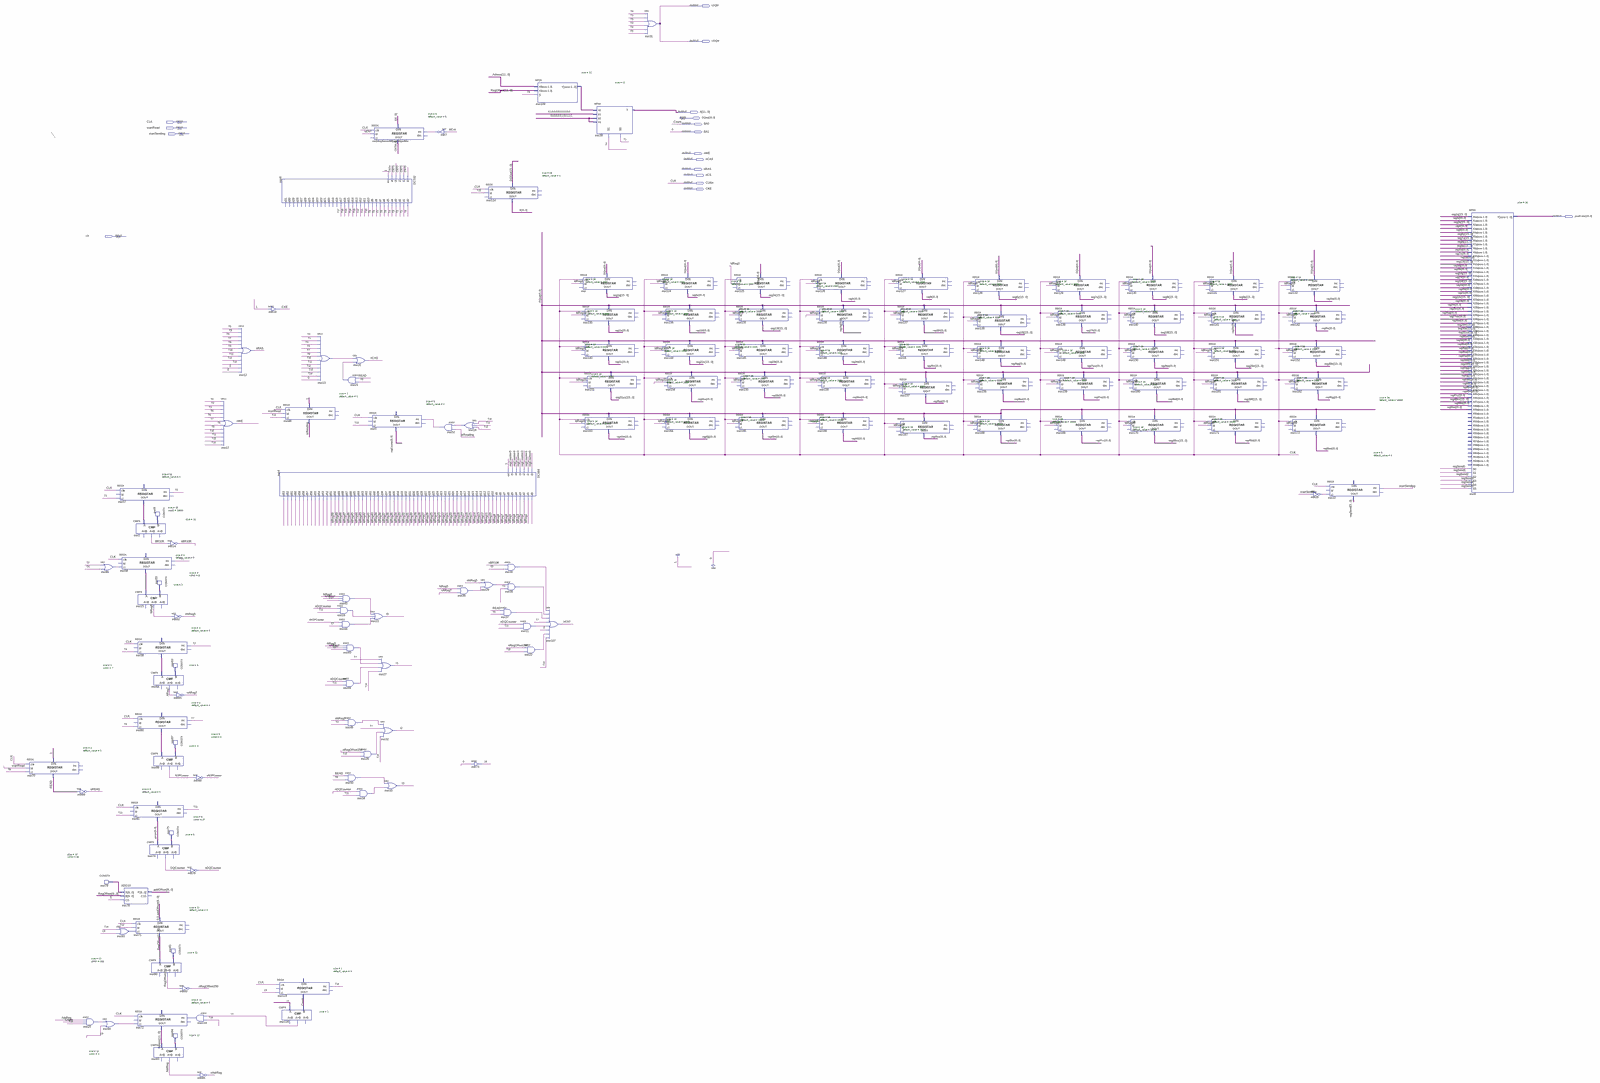
[diagram p0: schematic sheet, whole]
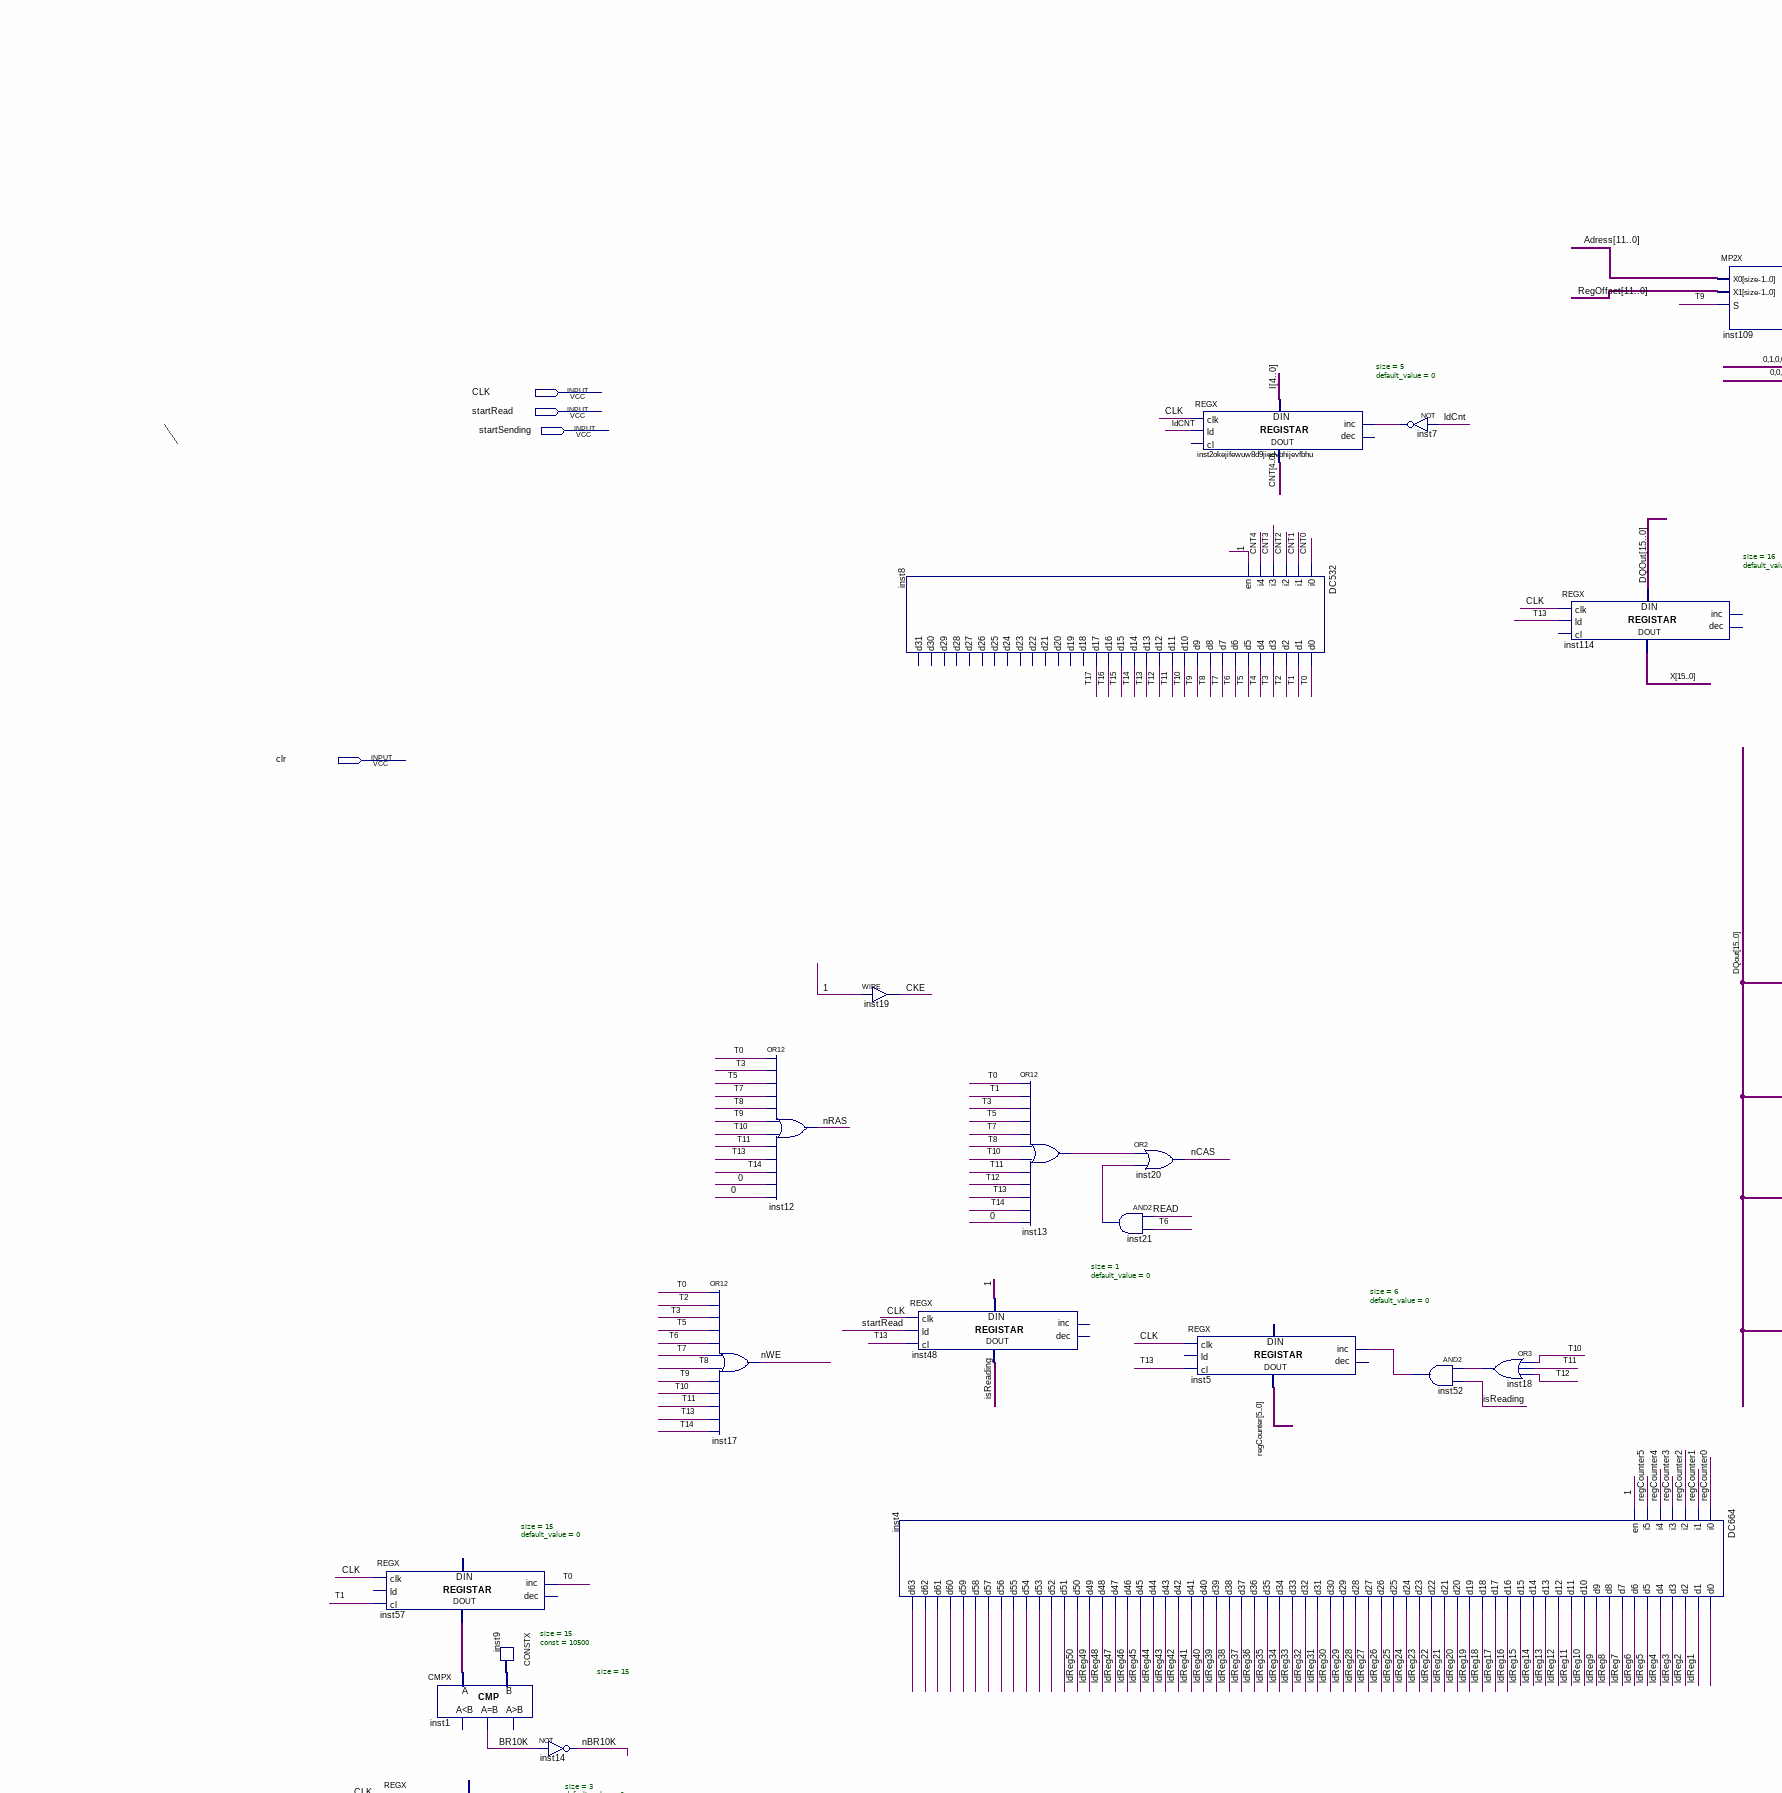
[diagram p1: schematic sheet, upper left part]
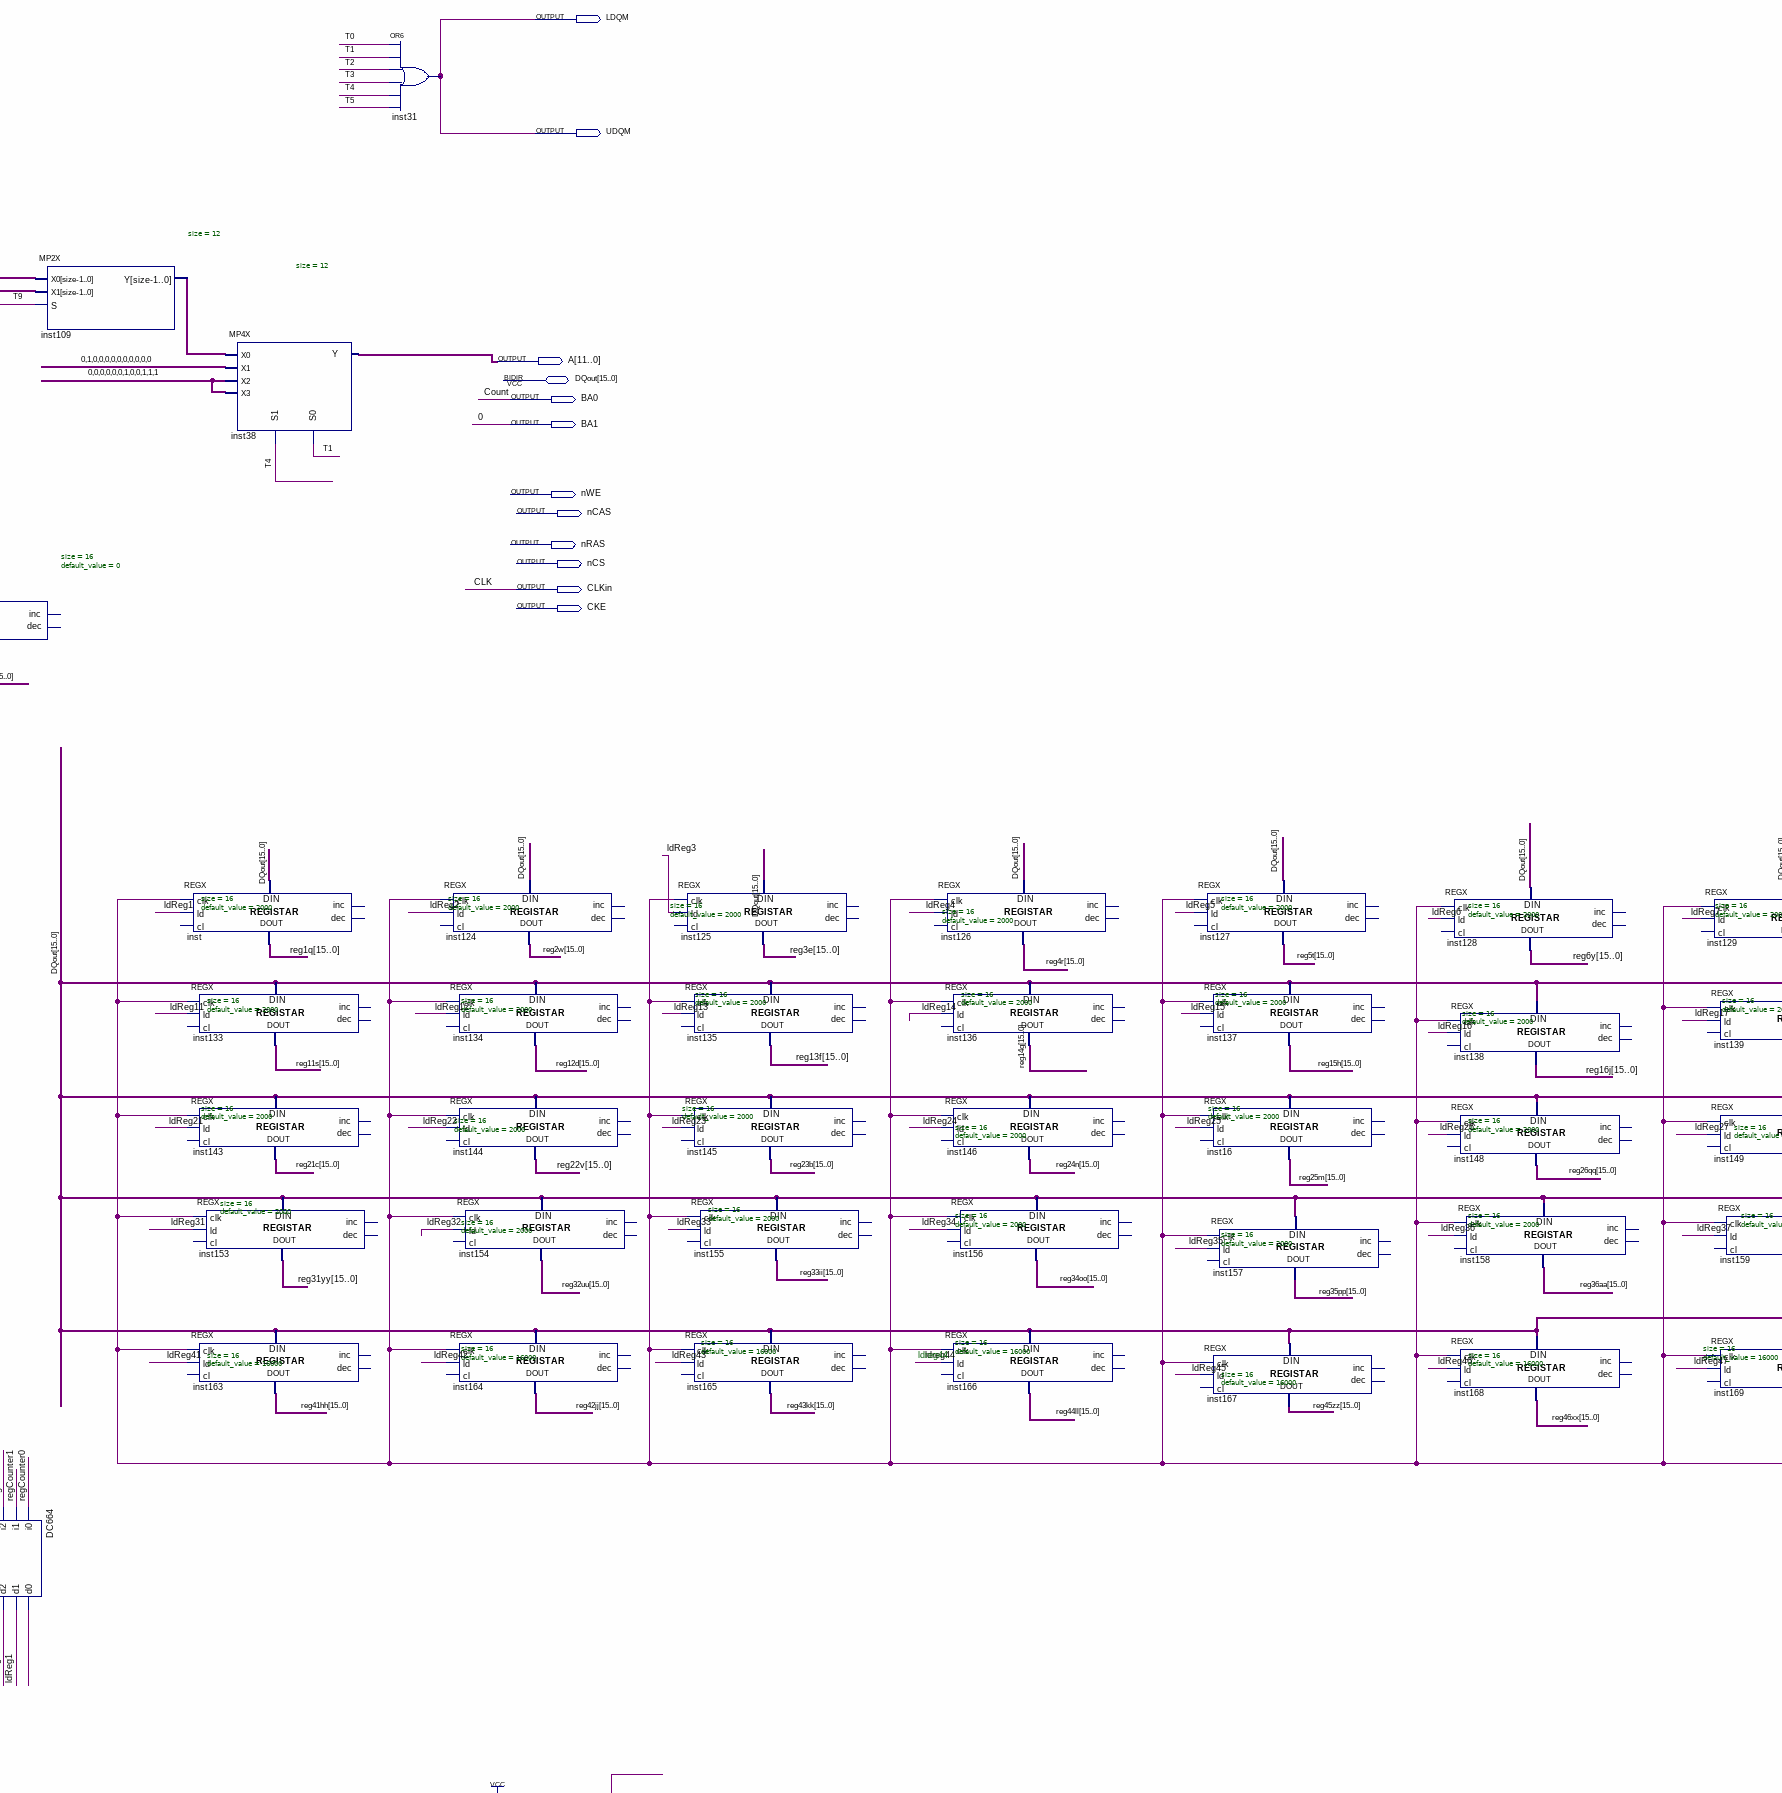
[diagram p2: schematic sheet, upper centre part]
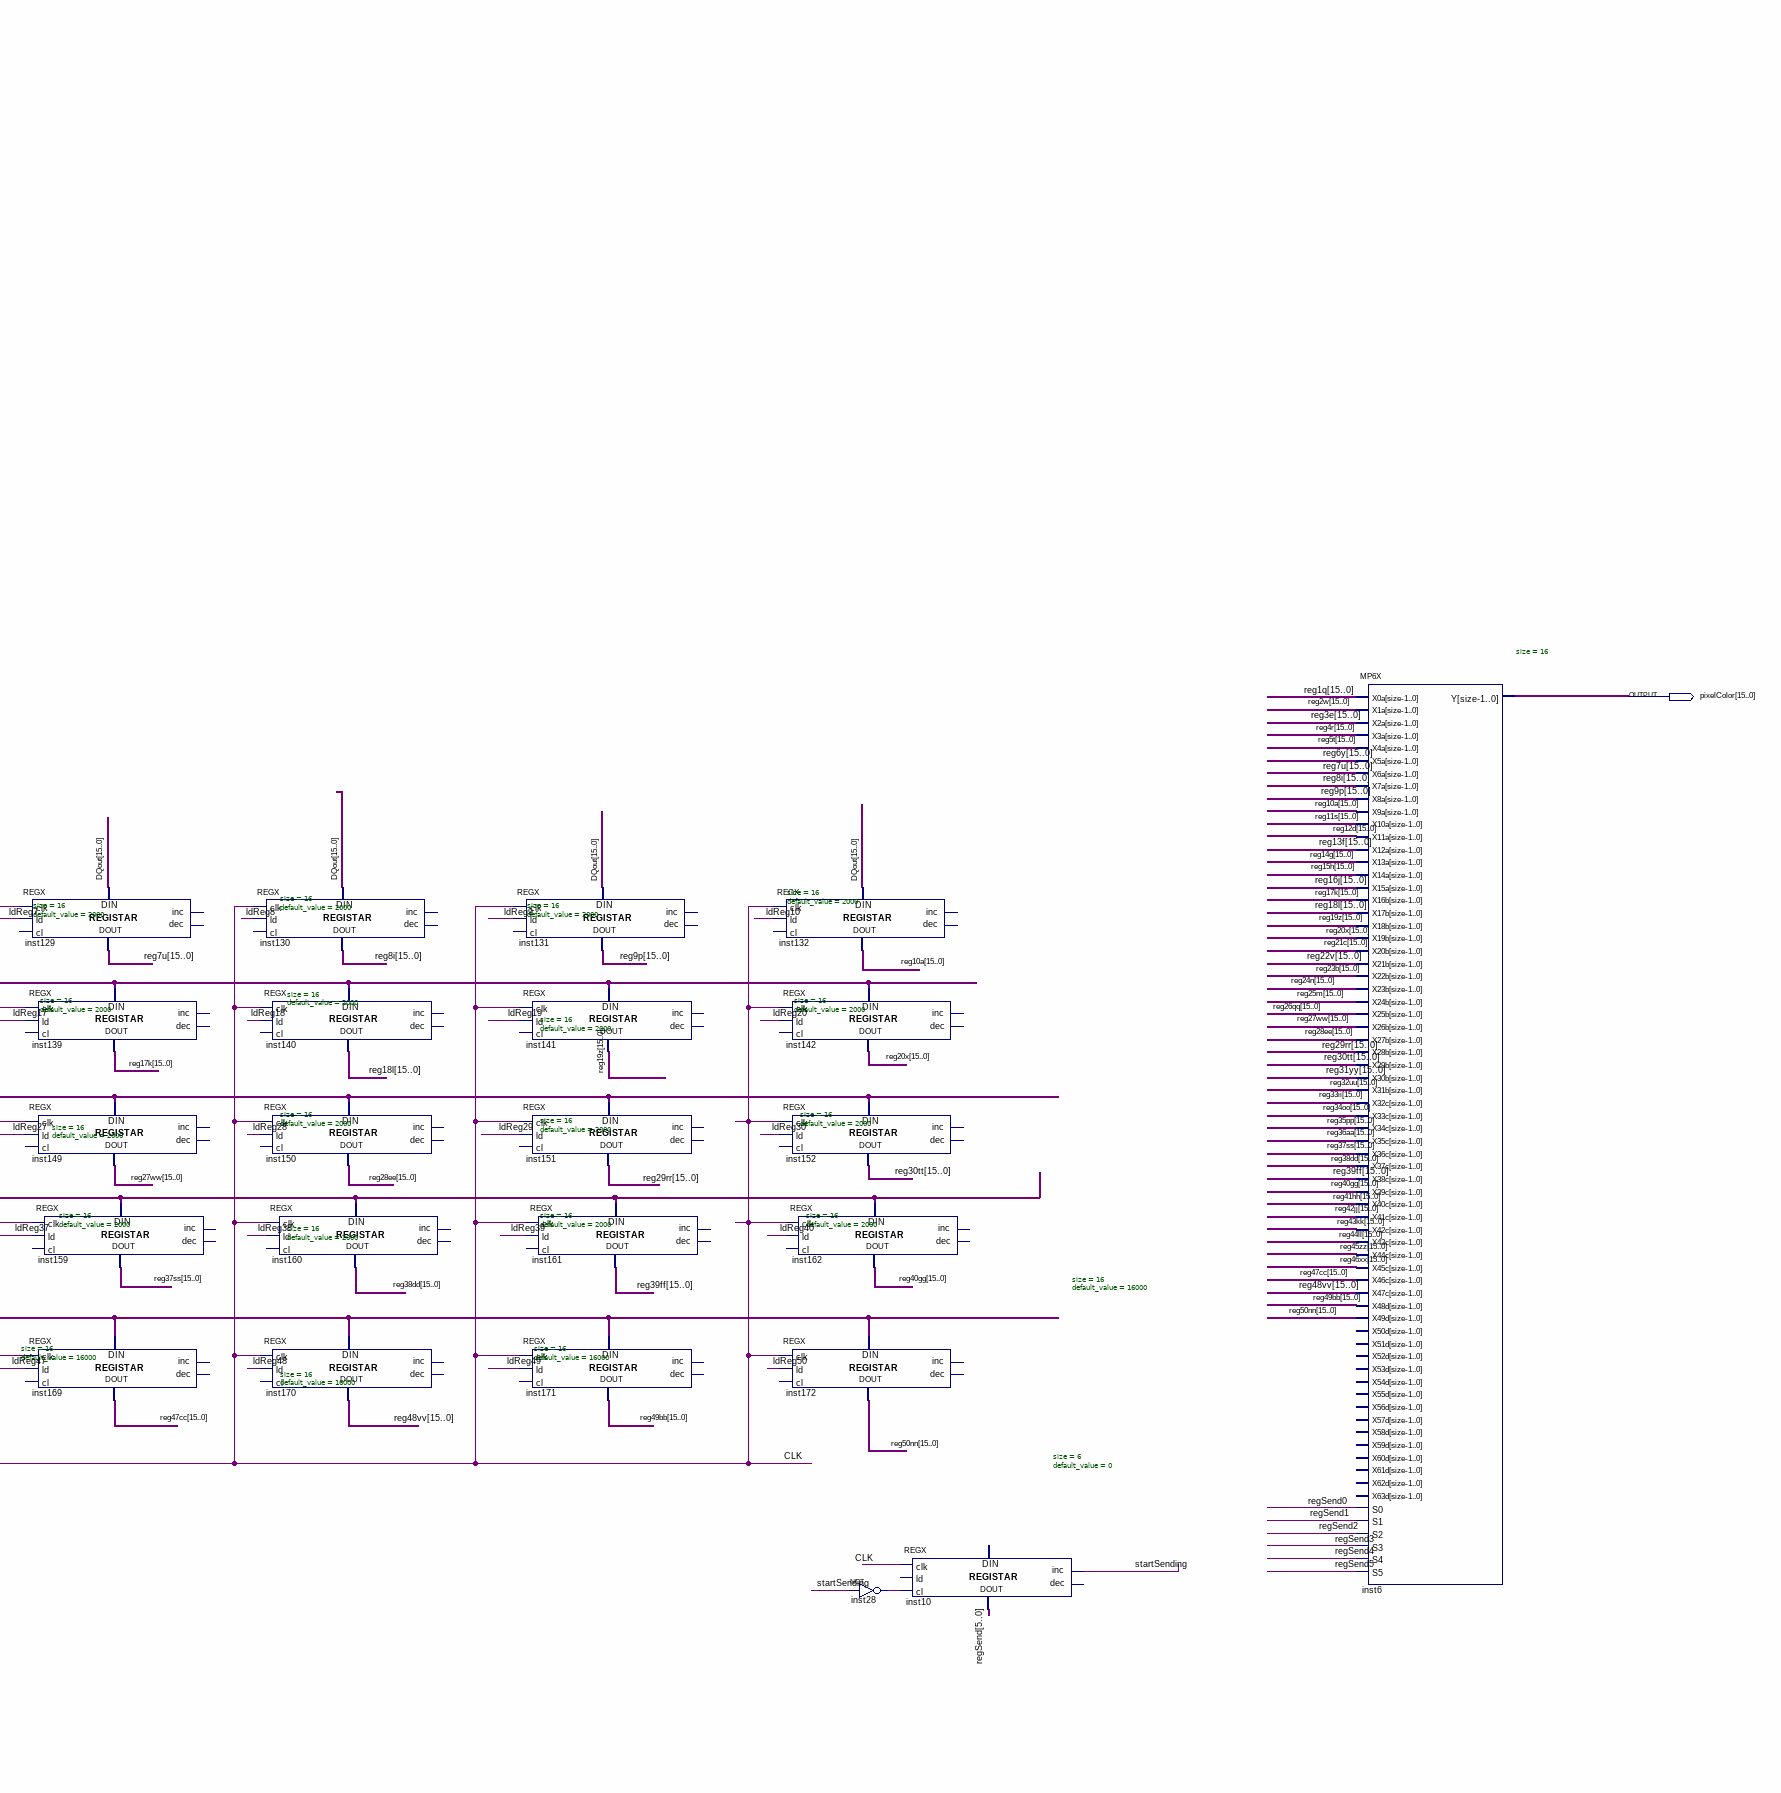
[diagram p3: schematic sheet, upper right part]
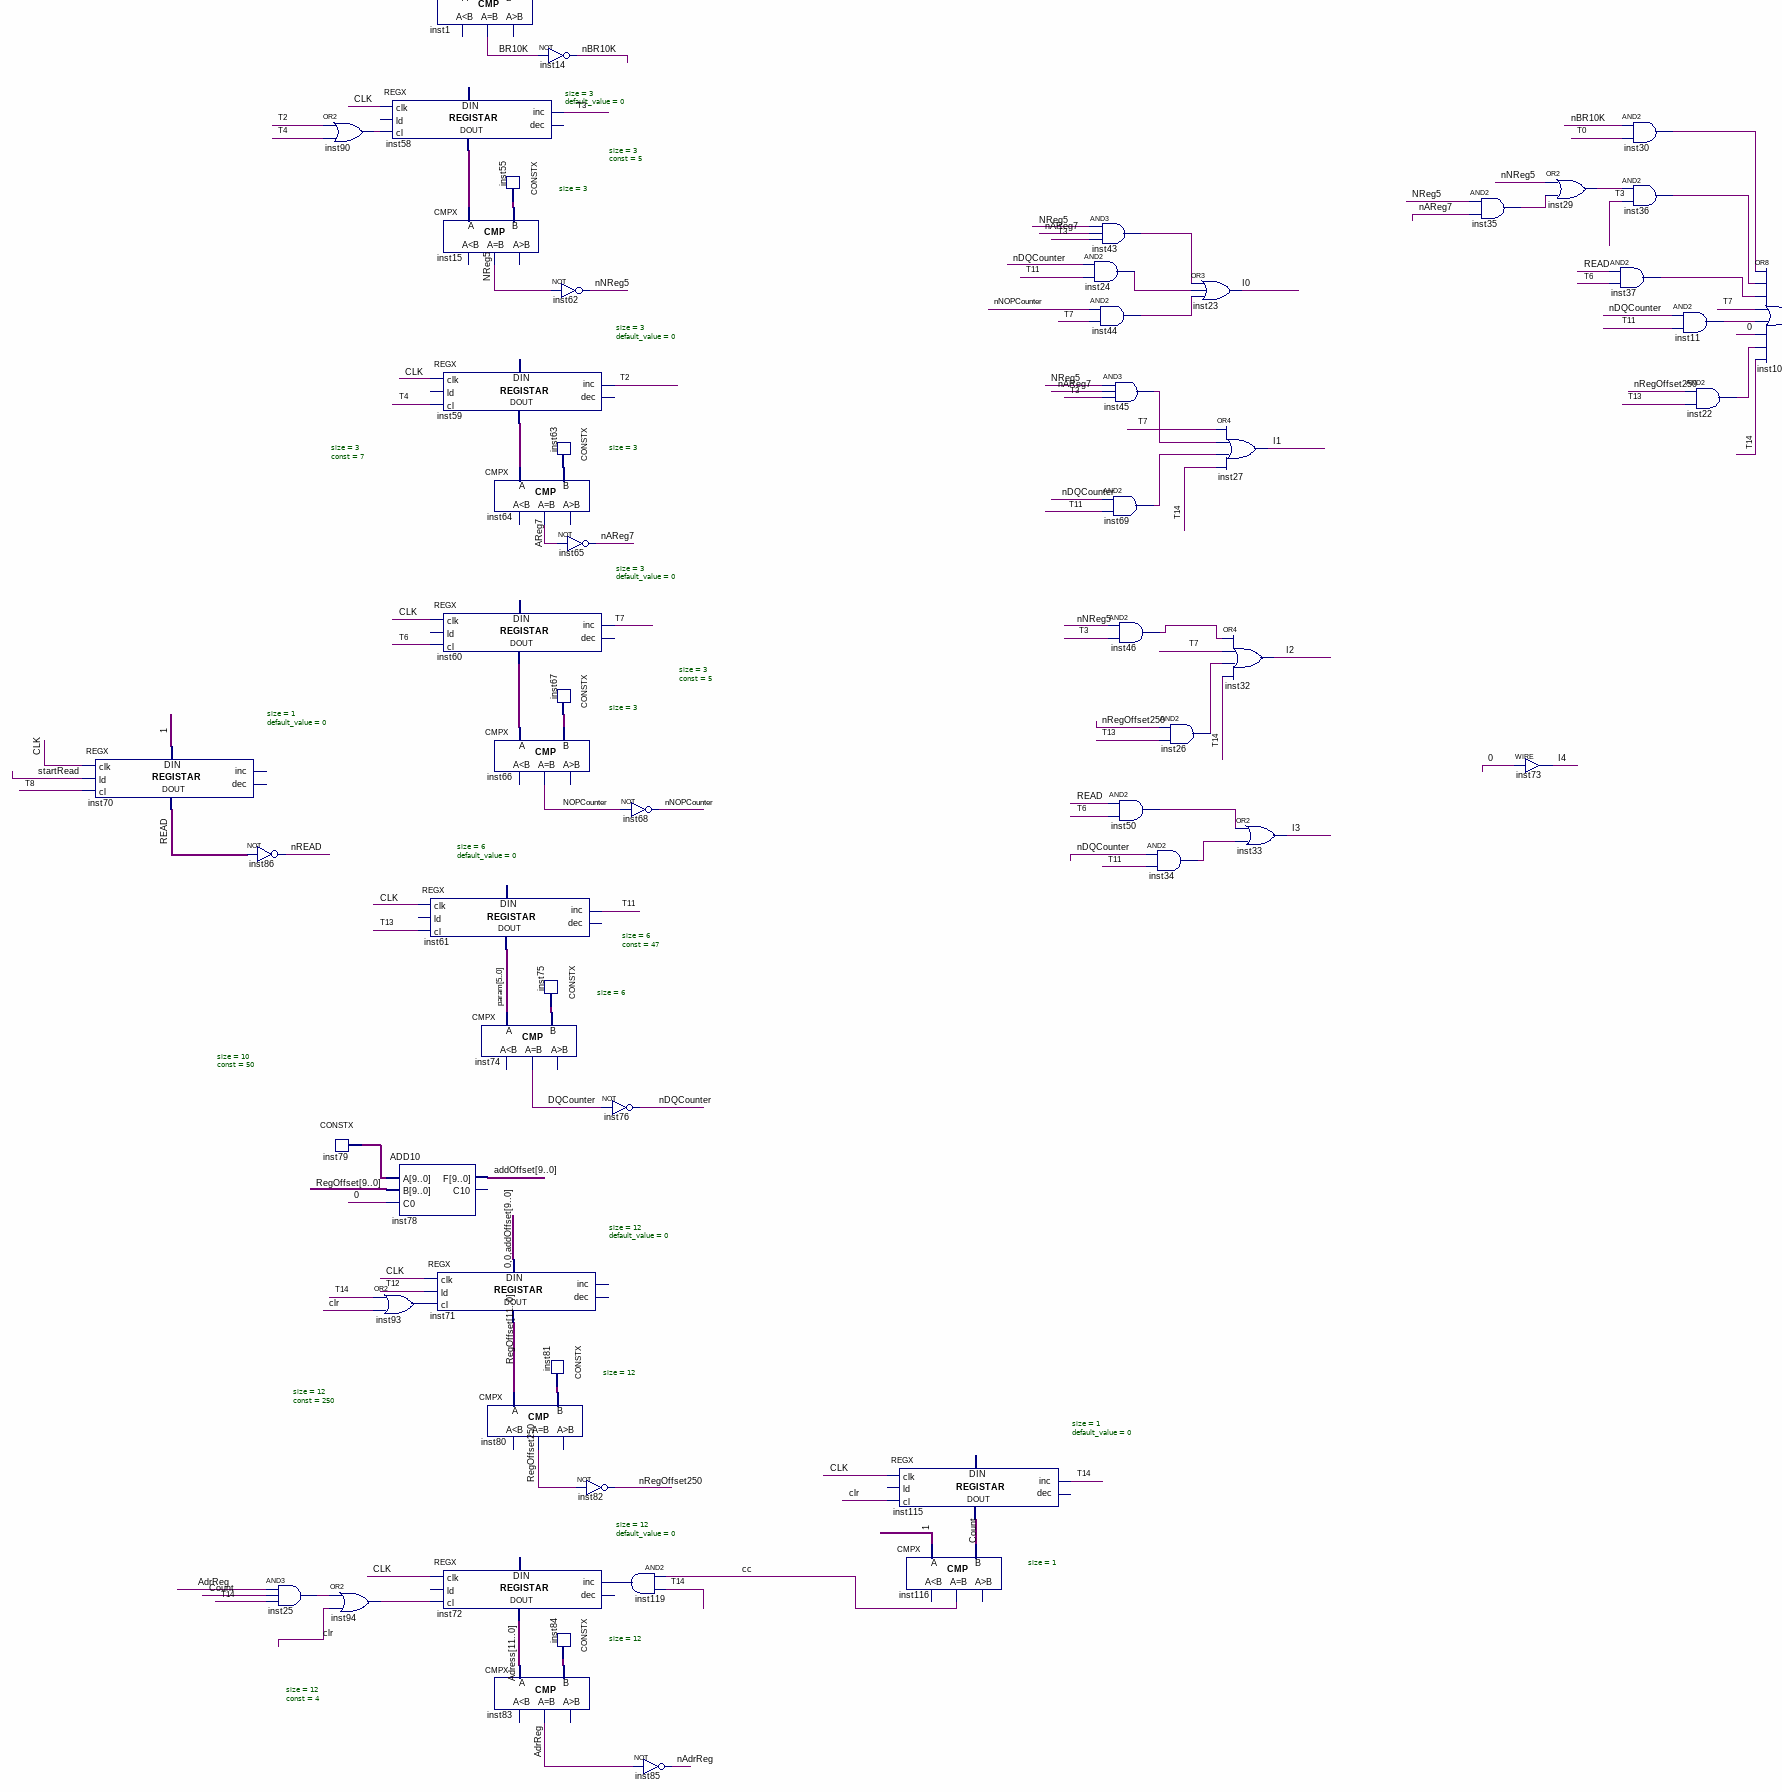
[diagram p4: schematic sheet, lower left part]
// Quartus schematic MemoryController.bdf as structural Verilog: 132 symbols, 17 pins
module MemoryController (
  input  CLK,
  input  startRead,
  input  startSending,
  input  clr,
  inout  [15:0] DQout,
  output LDQM,
  output UDQM,
  output [11:0] A,
  output BA0,
  output BA1,
  output nWE,
  output nCAS,
  output nRAS,
  output nCS,
  output CLKin,
  output CKE,
  output [15:0] pixelColor
);

  wire AdrReg, AReg7, BR10K, cc, DQCounter, inst4_d0, inst4_d51, inst4_d52, inst4_d53, inst4_d54, inst4_d55,
       inst4_d56, inst4_d57, inst4_d58, inst4_d59, inst4_d60, inst4_d61, inst4_d62, inst4_d63, inst7_out,
       inst11_out, inst13_out, inst18_out, inst21_out, inst22_out, inst24_out, inst25_out, inst26_out,
       inst28_out, inst29_out, inst30_out, inst34_out, inst35_out, inst36_out, inst37_out, inst43_out,
       inst44_out, inst45_out, inst46_out, inst50_out, inst52_out, inst69_out, inst90_out, inst93_out,
       inst94_out, inst119_out, isReading, ldCnt, ldReg1, ldReg2, ldReg3, ldReg4, ldReg5, ldReg6, ldReg7,
       ldReg8, ldReg9, ldReg10, ldReg11, ldReg12, ldReg13, ldReg14, ldReg15, ldReg16, ldReg17, ldReg18,
       ldReg19, ldReg20, ldReg21, ldReg22, ldReg23, ldReg24, ldReg25, ldReg26, ldReg27, ldReg28, ldReg29,
       ldReg30, ldReg31, ldReg32, ldReg33, ldReg34, ldReg35, ldReg36, ldReg37, ldReg38, ldReg39, ldReg40,
       ldReg41, ldReg42, ldReg43, ldreg44, ldReg45, ldReg46, ldReg47, ldReg48, ldReg49, ldReg50, nAdrReg,
       nAReg7, nBR10K, nDQCounter, nNOPCounter, nNReg5, NOPCounter, nREAD, NReg5, nRegOffset250, READ,
       RegOffset250, T0, T1, T2, T3, T4, T5, T6, T7, T8, T9, T10, T11, T12, T13, T14, T15, T16, T17;
  wire [2:0] inst55_data, inst58_data_out, inst59_data_out, inst60_data_out, inst63_data, inst67_data;
  wire [4:0] CNT, I;
  wire [5:0] inst75_data, param, regCounter, regSend;
  wire [9:0] addOffset, inst79_data;
  wire [11:0] Adress, inst81_data, inst84_data, inst109_y, RegOffset;
  wire [14:0] inst9_data, inst57_data_out;
  wire [15:0] reg1q, reg2w, reg3e, reg4r, reg5t, reg6y, reg7u, reg8i, reg9p, reg10a, reg11s, reg12d, reg13f,
       reg14g, reg15h, reg16j, reg17k, reg18l, reg19z, reg20x, reg21c, reg22v, reg23b, reg24n, reg25m,
       reg26qq, reg27ww, reg28ee, reg29rr, reg30tt, reg31yy, reg32uu, reg33ii, reg34oo, reg35pp, reg36aa,
       reg37ss, reg38dd, reg39ff, reg40gg, reg41hh, reg42jj, reg43kk, reg44ll, reg45zz, reg46xx, reg47cc,
       reg48vv, reg49bb, reg50nn, X;

  REGX #(.size(1), .default_value(0)) inst70 (
    .clk(CLK), .ld(startRead), .cl(T8), .data_in(1'b1), .data_out(READ));  // open: inc, dec
  not inst86 (nREAD, READ);
  and inst25 (inst25_out, AdrReg, BA0, T14);
  CONSTX #(.size(10), .\const (50)) inst79 (.data(inst79_data));
  or inst90 (inst90_out, T2, T4);
  or inst94 (inst94_out, inst25_out, clr);
  REGX #(.size(15), .default_value(0)) inst57 (
    .clk(CLK), .cl(T1), .inc(T0), .data_out(inst57_data_out));  // open: ld, dec, data_in
  REGX #(.size(3), .default_value(0)) inst58 (
    .clk(CLK), .cl(inst90_out), .inc(T3), .data_out(inst58_data_out));  // open: ld, dec, data_in
  REGX #(.size(6), .default_value(0)) inst61 (
    .clk(CLK), .cl(T13), .inc(T11), .data_out(param));  // open: ld, dec, data_in
  ADD10 inst78 (.A(inst79_data), .B(RegOffset[9:0]), .C0(1'b0), .F(addOffset));  // open: C10
  or inst93 (inst93_out, T14, clr);
  CMPX #(.size(15)) inst1 (.A(inst57_data_out), .B(inst9_data), .eq(BR10K));  // open: ls, gr
  CMPX #(.size(3)) inst15 (.A(inst58_data_out), .B(inst55_data), .eq(NReg5));  // open: ls, gr
  REGX #(.size(3), .default_value(0)) inst59 (
    .clk(CLK), .cl(T4), .inc(T2), .data_out(inst59_data_out));  // open: ld, dec, data_in
  REGX #(.size(3), .default_value(0)) inst60 (
    .clk(CLK), .cl(T6), .inc(T7), .data_out(inst60_data_out));  // open: ld, dec, data_in
  CMPX #(.size(6)) inst74 (.A(param), .B(inst75_data), .eq(DQCounter));  // open: ls, gr
  REGX #(.size(12), .default_value(0)) inst71 (
    .clk(CLK), .ld(T12), .cl(inst93_out), .data_in({2'b00, addOffset}), .data_out(RegOffset));  // open: inc, dec
  REGX #(.size(12), .default_value(0)) inst72 (
    .clk(CLK), .cl(inst94_out), .inc(inst119_out), .data_out(Adress));  // open: ld, dec, data_in
  CONSTX #(.size(15), .\const (10500)) inst9 (.data(inst9_data));
  CONSTX #(.size(3), .\const (5)) inst55 (.data(inst55_data));
  CMPX #(.size(3)) inst64 (.A(inst59_data_out), .B(inst63_data), .eq(AReg7));  // open: ls, gr
  CMPX #(.size(3)) inst66 (.A(inst60_data_out), .B(inst67_data), .eq(NOPCounter));  // open: ls, gr
  CMPX #(.size(12)) inst80 (.A(RegOffset), .B(inst81_data), .eq(RegOffset250));  // open: ls, gr
  CMPX #(.size(12)) inst83 (.A(Adress), .B(inst84_data), .eq(AdrReg));  // open: ls, gr
  not inst14 (nBR10K, BR10K);
  not inst62 (nNReg5, NReg5);
  CONSTX #(.size(3), .\const (7)) inst63 (.data(inst63_data));
  not inst65 (nAReg7, AReg7);
  CONSTX #(.size(3), .\const (5)) inst67 (.data(inst67_data));
  CONSTX #(.size(6), .\const (47)) inst75 (.data(inst75_data));
  CONSTX #(.size(12), .\const (250)) inst81 (.data(inst81_data));
  CONSTX #(.size(12), .\const (4)) inst84 (.data(inst84_data));
  not inst68 (nNOPCounter, NOPCounter);
  not inst76 (nDQCounter, DQCounter);
  not inst82 (nRegOffset250, RegOffset250);
  and inst119 (inst119_out, cc, T14);
  not inst85 (nAdrReg, AdrReg);
  or inst17 (nWE, T0, T2, T3, T5, T6, T7, T8, T9, T10, T11, T13, T14);
  or inst12 (nRAS, T0, T3, T5, T7, T8, T9, T10, T11, T13, T14, 1'b0, 1'b0);
  assign CKE = 1'b1;  // WIRE inst19
  DC532 inst8 (
    .i0(CNT[0]), .i1(CNT[1]), .i2(CNT[2]), .i3(CNT[3]), .i4(CNT[4]), .en(1'b1), .d0(T0), .d1(T1), .d2(T2),
    .d3(T3), .d4(T4), .d5(T5), .d6(T6), .d7(T7), .d8(T8), .d9(T9), .d10(T10), .d11(T11), .d12(T12),
    .d13(T13), .d14(T14), .d15(T15), .d16(T16), .d17(T17));  // open: d18, d19, d20, d21, d22, d23, d24, d25, d26, d27, d28, d29, d30, d31
  REGX #(.size(1), .default_value(0)) inst48 (
    .clk(CLK), .ld(startRead), .cl(T13), .data_in(1'b1), .data_out(isReading));  // open: inc, dec
  DC664 inst4 (
    .i0(regCounter[0]), .i1(regCounter[1]), .i2(regCounter[2]), .i3(regCounter[3]), .i4(regCounter[4]),
    .i5(regCounter[5]), .en(1'b1), .d0(inst4_d0), .d1(ldReg1), .d2(ldReg2), .d3(ldReg3), .d4(ldReg4),
    .d5(ldReg5), .d6(ldReg6), .d7(ldReg7), .d8(ldReg8), .d9(ldReg9), .d10(ldReg10), .d11(ldReg11),
    .d12(ldReg12), .d13(ldReg13), .d14(ldReg14), .d15(ldReg15), .d16(ldReg16), .d17(ldReg17), .d18(ldReg18),
    .d19(ldReg19), .d20(ldReg20), .d21(ldReg21), .d22(ldReg22), .d23(ldReg23), .d24(ldReg24), .d25(ldReg25),
    .d26(ldReg26), .d27(ldReg27), .d28(ldReg28), .d29(ldReg29), .d30(ldReg30), .d31(ldReg31), .d32(ldReg32),
    .d33(ldReg33), .d34(ldReg34), .d35(ldReg35), .d36(ldReg36), .d37(ldReg37), .d38(ldReg38), .d39(ldReg39),
    .d40(ldReg40), .d41(ldReg41), .d42(ldReg42), .d43(ldReg43), .d44(ldreg44), .d45(ldReg45), .d46(ldReg46),
    .d47(ldReg47), .d48(ldReg48), .d49(ldReg49), .d50(ldReg50), .d51(inst4_d51), .d52(inst4_d52),
    .d53(inst4_d53), .d54(inst4_d54), .d55(inst4_d55), .d56(inst4_d56), .d57(inst4_d57), .d58(inst4_d58),
    .d59(inst4_d59), .d60(inst4_d60), .d61(inst4_d61), .d62(inst4_d62), .d63(inst4_d63));
  REGX #(.size(1), .default_value(0)) inst115 (
    .clk(CLK), .cl(clr), .inc(T14), .data_out(BA0));  // open: ld, dec, data_in
  CMPX #(.size(1)) inst116 (.A(1'b1), .B(BA0), .eq(cc));  // open: ls, gr
  or inst13 (inst13_out, T0, T1, T3, T5, T7, T8, T10, T11, T12, T13, T14, 1'b0);
  and inst21 (inst21_out, READ, T6);
  and inst43 (inst43_out, NReg5, nAReg7, T3);
  and inst24 (inst24_out, nDQCounter, T11);
  and inst44 (inst44_out, nNOPCounter, T7);
  and inst45 (inst45_out, NReg5, nAReg7, T3);
  and inst69 (inst69_out, nDQCounter, T11);
  and inst46 (inst46_out, nNReg5, T3);
  and inst50 (inst50_out, READ, T6);
  or inst20 (nCAS, inst13_out, inst21_out);
  and inst26 (inst26_out, nRegOffset250, T13);
  and inst34 (inst34_out, nDQCounter, T11);
  REGX #(.size(5), .default_value(0)) inst2okejifewuw8d9jiedvbhijevfbhu (
    .clk(CLK), .ld(ldCnt), .inc(inst7_out), .data_in(I), .data_out(CNT));  // open: cl, dec
  REGX #(.size(6), .default_value(0)) inst5 (
    .clk(CLK), .cl(T13), .inc(inst52_out), .data_out(regCounter));  // open: ld, dec, data_in
  or inst23 (I[0], inst43_out, inst24_out, inst44_out);
  or inst27 (I[1], T7, inst45_out, inst69_out, T14);
  or inst32 (I[2], inst46_out, T7, inst26_out, T14);
  or inst33 (I[3], inst50_out, inst34_out);
  not inst7 (inst7_out, ldCnt);
  and inst52 (inst52_out, inst18_out, isReading);
  or inst18 (inst18_out, T10, T11, T12);
  and inst35 (inst35_out, NReg5, nAReg7);
  assign I[4] = 1'b0;  // WIRE inst73
  REGX #(.size(16), .default_value(0)) inst114 (
    .clk(CLK), .ld(T13), .data_in(DQout), .data_out(X));  // open: cl, inc, dec
  or inst29 (inst29_out, nNReg5, inst35_out);
  and inst30 (inst30_out, nBR10K, T0);
  and inst36 (inst36_out, inst29_out, T3);
  and inst37 (inst37_out, READ, T6);
  and inst11 (inst11_out, nDQCounter, T11);
  and inst22 (inst22_out, nRegOffset250, T13);
  MP2X #(.size(12)) inst109 (.X0(Adress), .X1(RegOffset), .S(T9), .Y(inst109_y));
  or inst107 (ldCnt, inst30_out, inst36_out, inst37_out, T7, inst11_out, 1'b0, inst22_out, T14);
  REGX #(.size(16), .default_value(2000)) inst (
    .clk(CLK), .ld(ldReg1), .data_in(DQout), .data_out(reg1q));  // open: cl, inc, dec
  REGX #(.size(16), .default_value(2000)) inst133 (
    .clk(CLK), .ld(ldReg11), .data_in(DQout), .data_out(reg11s));  // open: cl, inc, dec
  REGX #(.size(16), .default_value(2000)) inst143 (
    .clk(CLK), .ld(ldReg21), .data_in(DQout), .data_out(reg21c));  // open: cl, inc, dec
  REGX #(.size(16), .default_value(2000)) inst153 (
    .clk(CLK), .ld(ldReg31), .data_in(DQout), .data_out(reg31yy));  // open: cl, inc, dec
  REGX #(.size(16), .default_value(16000)) inst163 (
    .clk(CLK), .ld(ldReg41), .data_in(DQout), .data_out(reg41hh));  // open: cl, inc, dec
  MP4X #(.size(12)) inst38 (
    .X0(inst109_y), .X1(12'b010000000000), .X2(12'b000000100111), .X3(12'b000000100111), .S1(T4), .S0(T1),
    .Y(A));
  or inst31 (LDQM, T0, T1, T2, T3, T4, T5);
  REGX #(.size(16), .default_value(2000)) inst124 (
    .clk(CLK), .ld(ldReg2), .data_in(DQout), .data_out(reg2w));  // open: cl, inc, dec
  REGX #(.size(16), .default_value(2000)) inst134 (
    .clk(CLK), .ld(ldReg12), .data_in(DQout), .data_out(reg12d));  // open: cl, inc, dec
  REGX #(.size(16), .default_value(2000)) inst144 (
    .clk(CLK), .ld(ldReg22), .data_in(DQout), .data_out(reg22v));  // open: cl, inc, dec
  REGX #(.size(16), .default_value(2000)) inst154 (
    .clk(CLK), .ld(ldReg32), .data_in(DQout), .data_out(reg32uu));  // open: cl, inc, dec
  REGX #(.size(16), .default_value(16000)) inst164 (
    .clk(CLK), .ld(ldReg42), .data_in(DQout), .data_out(reg42jj));  // open: cl, inc, dec
  REGX #(.size(16), .default_value(2000)) inst125 (
    .clk(CLK), .ld(ldReg3), .data_in(DQout), .data_out(reg3e));  // open: cl, inc, dec
  REGX #(.size(16), .default_value(2000)) inst135 (
    .clk(CLK), .ld(ldReg13), .data_in(DQout), .data_out(reg13f));  // open: cl, inc, dec
  REGX #(.size(16), .default_value(2000)) inst145 (
    .clk(CLK), .ld(ldReg23), .data_in(DQout), .data_out(reg23b));  // open: cl, inc, dec
  REGX #(.size(16), .default_value(2000)) inst155 (
    .clk(CLK), .ld(ldReg33), .data_in(DQout), .data_out(reg33ii));  // open: cl, inc, dec
  REGX #(.size(16), .default_value(16000)) inst165 (
    .clk(CLK), .ld(ldReg43), .data_in(DQout), .data_out(reg43kk));  // open: cl, inc, dec
  REGX #(.size(16), .default_value(2000)) inst126 (
    .clk(CLK), .ld(ldReg4), .data_in(DQout), .data_out(reg4r));  // open: cl, inc, dec
  REGX #(.size(16), .default_value(2000)) inst136 (
    .clk(CLK), .ld(ldReg14), .data_in(DQout), .data_out(reg14g));  // open: cl, inc, dec
  REGX #(.size(16), .default_value(2000)) inst146 (
    .clk(CLK), .ld(ldReg24), .data_in(DQout), .data_out(reg24n));  // open: cl, inc, dec
  REGX #(.size(16), .default_value(2000)) inst156 (
    .clk(CLK), .ld(ldReg34), .data_in(DQout), .data_out(reg34oo));  // open: cl, inc, dec
  REGX #(.size(16), .default_value(16000)) inst166 (
    .clk(CLK), .ld(ldreg44), .data_in(DQout), .data_out(reg44ll));  // open: cl, inc, dec
  REGX #(.size(16), .default_value(2000)) inst127 (
    .clk(CLK), .ld(ldReg5), .data_in(DQout), .data_out(reg5t));  // open: cl, inc, dec
  REGX #(.size(16), .default_value(2000)) inst137 (
    .clk(CLK), .ld(ldReg15), .data_in(DQout), .data_out(reg15h));  // open: cl, inc, dec
  REGX #(.size(16), .default_value(2000)) inst16 (
    .clk(CLK), .ld(ldReg25), .data_in(DQout), .data_out(reg25m));  // open: cl, inc, dec
  REGX #(.size(16), .default_value(2000)) inst157 (
    .clk(CLK), .ld(ldReg35), .data_in(DQout), .data_out(reg35pp));  // open: cl, inc, dec
  REGX #(.size(16), .default_value(16000)) inst167 (
    .clk(CLK), .ld(ldReg45), .data_in(DQout), .data_out(reg45zz));  // open: cl, inc, dec
  REGX #(.size(16), .default_value(2000)) inst128 (
    .clk(CLK), .ld(ldReg6), .data_in(DQout), .data_out(reg6y));  // open: cl, inc, dec
  REGX #(.size(16), .default_value(2000)) inst138 (
    .clk(CLK), .ld(ldReg16), .data_in(DQout), .data_out(reg16j));  // open: cl, inc, dec
  REGX #(.size(16), .default_value(2000)) inst148 (
    .clk(CLK), .ld(ldReg26), .data_in(DQout), .data_out(reg26qq));  // open: cl, inc, dec
  REGX #(.size(16), .default_value(2000)) inst158 (
    .clk(CLK), .ld(ldReg36), .data_in(DQout), .data_out(reg36aa));  // open: cl, inc, dec
  REGX #(.size(16), .default_value(16000)) inst168 (
    .clk(CLK), .ld(ldReg46), .data_in(DQout), .data_out(reg46xx));  // open: cl, inc, dec
  REGX #(.size(16), .default_value(2000)) inst129 (
    .clk(CLK), .ld(ldReg7), .data_in(DQout), .data_out(reg7u));  // open: cl, inc, dec
  REGX #(.size(16), .default_value(2000)) inst139 (
    .clk(CLK), .ld(ldReg17), .data_in(DQout), .data_out(reg17k));  // open: cl, inc, dec
  REGX #(.size(16), .default_value(2000)) inst149 (
    .clk(CLK), .ld(ldReg27), .data_in(DQout), .data_out(reg27ww));  // open: cl, inc, dec
  REGX #(.size(16), .default_value(2000)) inst159 (
    .clk(CLK), .ld(ldReg37), .data_in(DQout), .data_out(reg37ss));  // open: cl, inc, dec
  REGX #(.size(16), .default_value(16000)) inst169 (
    .clk(CLK), .ld(ldReg47), .data_in(DQout), .data_out(reg47cc));  // open: cl, inc, dec
  REGX #(.size(16), .default_value(2000)) inst130 (
    .clk(CLK), .ld(ldReg8), .data_in(DQout), .data_out(reg8i));  // open: cl, inc, dec
  REGX #(.size(16), .default_value(2000)) inst140 (
    .clk(CLK), .ld(ldReg18), .data_in(DQout), .data_out(reg18l));  // open: cl, inc, dec
  REGX #(.size(16), .default_value(2000)) inst150 (
    .clk(CLK), .ld(ldReg28), .data_in(DQout), .data_out(reg28ee));  // open: cl, inc, dec
  REGX #(.size(16), .default_value(2000)) inst160 (
    .clk(CLK), .ld(ldReg38), .data_in(DQout), .data_out(reg38dd));  // open: cl, inc, dec
  REGX #(.size(16), .default_value(16000)) inst170 (
    .clk(CLK), .ld(ldReg48), .data_in(DQout), .data_out(reg48vv));  // open: cl, inc, dec
  REGX #(.size(16), .default_value(2000)) inst131 (
    .clk(CLK), .ld(ldReg9), .data_in(DQout), .data_out(reg9p));  // open: cl, inc, dec
  REGX #(.size(16), .default_value(2000)) inst141 (
    .clk(CLK), .ld(ldReg19), .data_in(DQout), .data_out(reg19z));  // open: cl, inc, dec
  REGX #(.size(16), .default_value(2000)) inst151 (
    .clk(CLK), .ld(ldReg29), .data_in(DQout), .data_out(reg29rr));  // open: cl, inc, dec
  REGX #(.size(16), .default_value(2000)) inst161 (
    .clk(CLK), .ld(ldReg39), .data_in(DQout), .data_out(reg39ff));  // open: cl, inc, dec
  REGX #(.size(16), .default_value(16000)) inst171 (
    .clk(CLK), .ld(ldReg49), .data_in(DQout), .data_out(reg49bb));  // open: cl, inc, dec
  REGX #(.size(16), .default_value(2000)) inst132 (
    .clk(CLK), .ld(ldReg10), .data_in(DQout), .data_out(reg10a));  // open: cl, inc, dec
  REGX #(.size(16), .default_value(2000)) inst142 (
    .clk(CLK), .ld(ldReg20), .data_in(DQout), .data_out(reg20x));  // open: cl, inc, dec
  REGX #(.size(16), .default_value(2000)) inst152 (
    .clk(CLK), .ld(ldReg30), .data_in(DQout), .data_out(reg30tt));  // open: cl, inc, dec
  REGX #(.size(16), .default_value(2000)) inst162 (
    .clk(CLK), .ld(ldReg40), .data_in(DQout), .data_out(reg40gg));  // open: cl, inc, dec
  REGX #(.size(16), .default_value(16000)) inst172 (
    .clk(CLK), .ld(ldReg50), .data_in(DQout), .data_out(reg50nn));  // open: cl, inc, dec
  not inst28 (inst28_out, startSending);
  REGX #(.size(6), .default_value(0)) inst10 (
    .clk(CLK), .cl(inst28_out), .inc(startSending), .data_out(regSend));  // open: ld, dec, data_in
  MP6X #(.size(16)) inst6 (
    .X0a(reg1q), .X1a(reg2w), .X2a(reg3e), .X3a(reg4r), .X4a(reg5t), .X5a(reg6y), .X6a(reg7u), .X7a(reg8i),
    .X8a(reg9p), .X9a(reg10a), .X10a(reg11s), .X11a(reg12d), .X12a(reg13f), .X13a(reg14g), .X14a(reg15h),
    .X15a(reg16j), .X16b(reg17k), .X17b(reg18l), .X18b(reg19z), .X19b(reg20x), .X20b(reg21c), .X21b(reg22v),
    .X22b(reg23b), .X23b(reg24n), .X24b(reg25m), .X25b(reg26qq), .X26b(reg27ww), .X27b(reg28ee),
    .X28b(reg29rr), .X29b(reg30tt), .X30b(reg31yy), .X31b(reg32uu), .X32c(reg33ii), .X33c(reg34oo),
    .X34c(reg35pp), .X35c(reg36aa), .X36c(reg37ss), .X37c(reg38dd), .X38c(reg39ff), .X39c(reg40gg),
    .X40c(reg41hh), .X41c(reg42jj), .X42c(reg43kk), .X43c(reg44ll), .X44c(reg45zz), .X45c(reg46xx),
    .X46c(reg47cc), .X47c(reg48vv), .X48d(reg49bb), .X49d(reg50nn), .S0(regSend[0]), .S1(regSend[1]),
    .S2(regSend[2]), .S3(regSend[3]), .S4(regSend[4]), .S5(regSend[5]), .Y(pixelColor));  // open: X50d, X51d, X52d, X53d, X54d, X55d, X56d, X57d, X58d, X59d, X60d, X61d, X62d, X63d

  assign BA1 = 1'b0;
  assign CLKin = CLK;
  assign UDQM = LDQM;

  // Other names for the same wires on the sheet: Count = BA0

  // Notes on the sheet:
  //   ldreg44
endmodule
